# EAGLE design amplifier_v0003 - 1 Channel Test (EAGLE 6.4)

## Sheet 1 of 2
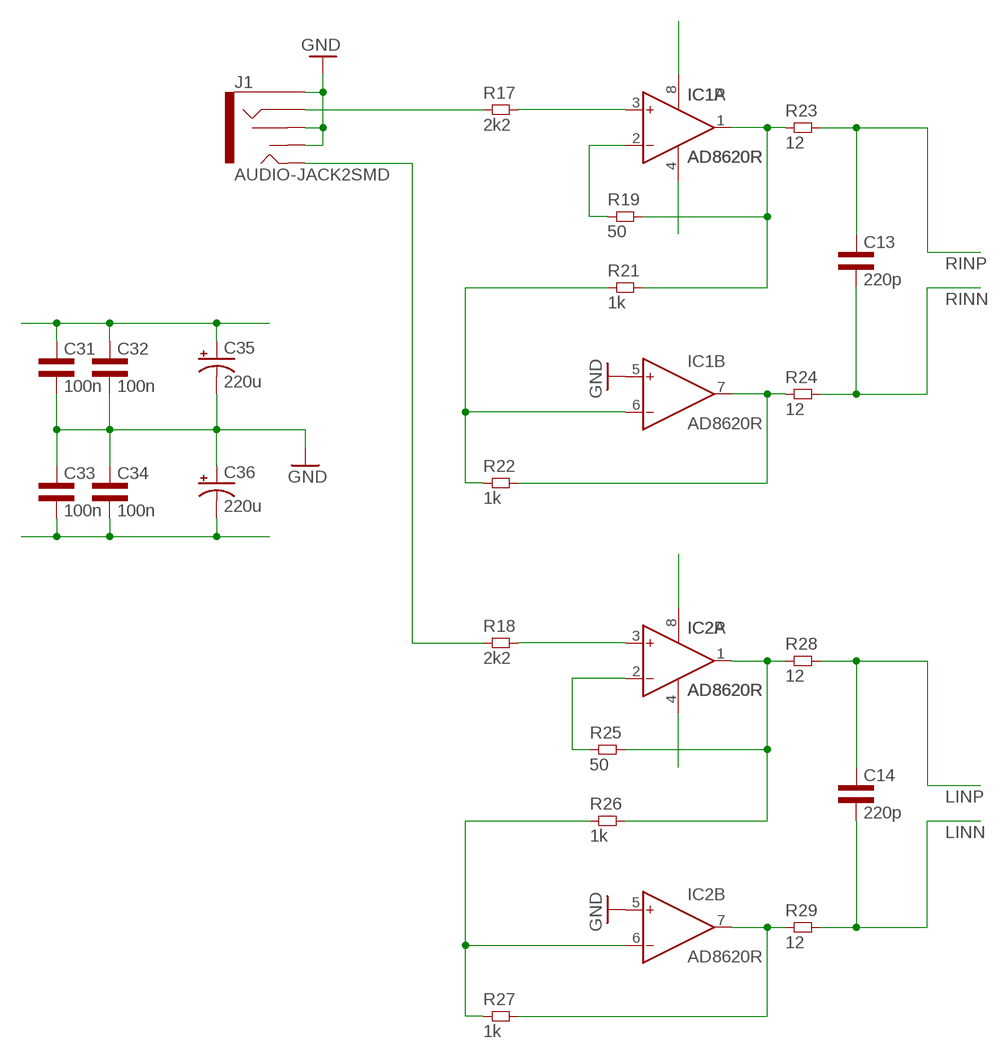
[diagram p0: schematic, sheet 1]

### Parts
C13  220p  CAP0603L3  [0603L3]
C14  220p  CAP0603L3  [0603L3]
C31  100n  CAP0603L3  [0603L3]
C32  100n  CAP0603L3  [0603L3]
C33  100n  CAP0603L3  [0603L3]
C34  100n  CAP0603L3  [0603L3]
C35  220u  CPOL-USCT7343  [CT7343]
C36  220u  CPOL-USCT7343  [CT7343]
IC1  AD8620R  [SO8]
IC2  AD8620R  [SO8]
J1  AUDIO-JACK2SMD  [AUDIO-JACK-3.5MM-SMD]
R17  2k2  RES0603L3  [0603L3]
R18  2k2  RES0603L3  [0603L3]
R19  50  RES0603L3  [0603L3]
R21  1k  RES0603L3  [0603L3]
R22  1k  RES0603L3  [0603L3]
R23  12  RES0603L3  [0603L3]
R24  12  RES0603L3  [0603L3]
R25  50  RES0603L3  [0603L3]
R26  1k  RES0603L3  [0603L3]
R27  1k  RES0603L3  [0603L3]
R28  12  RES0603L3  [0603L3]
R29  12  RES0603L3  [0603L3]

### Nets
GND: C31.P$2 C32.P$2 C33.P$1 C34.P$1 C35.- C36.+ IC1.5(B:IN+) IC2.5(B:IN+) J1.RSH J1.SLEEVE J1.TSH ; also sheet 2
LINN: C14.P$2 R29.P$2 ; also sheet 2
LINP: C14.P$1 R28.P$2 ; also sheet 2
N$7: IC1.3(A:IN+) R17.P$2
N$13: IC2.3(A:IN+) R18.P$2
N$15: J1.RING R17.P$1
N$16: J1.TIP R18.P$1
N$17: IC1.1(A:OUT) R19.P$2 R21.P$2 R23.P$1
N$18: IC1.7(B:OUT) R22.P$2 R24.P$1
N$21: IC1.6(B:IN-) R21.P$1 R22.P$1
N$22: IC1.2(A:IN-) R19.P$1
N$23: IC2.1(A:OUT) R25.P$2 R26.P$2 R28.P$1
N$24: IC2.7(B:OUT) R27.P$2 R29.P$1
N$25: IC2.6(B:IN-) R26.P$1 R27.P$1
N$26: IC2.2(A:IN-) R25.P$1
RINN: C13.P$2 R24.P$2 ; also sheet 2
RINP: C13.P$1 R23.P$2 ; also sheet 2
V+: C31.P$1 C32.P$1 C35.+ IC1.8(P:V+) IC2.8(P:V+)
V-: C33.P$2 C34.P$2 C36.- IC1.4(P:V-) IC2.4(P:V-)

## Sheet 2 of 2: Amp
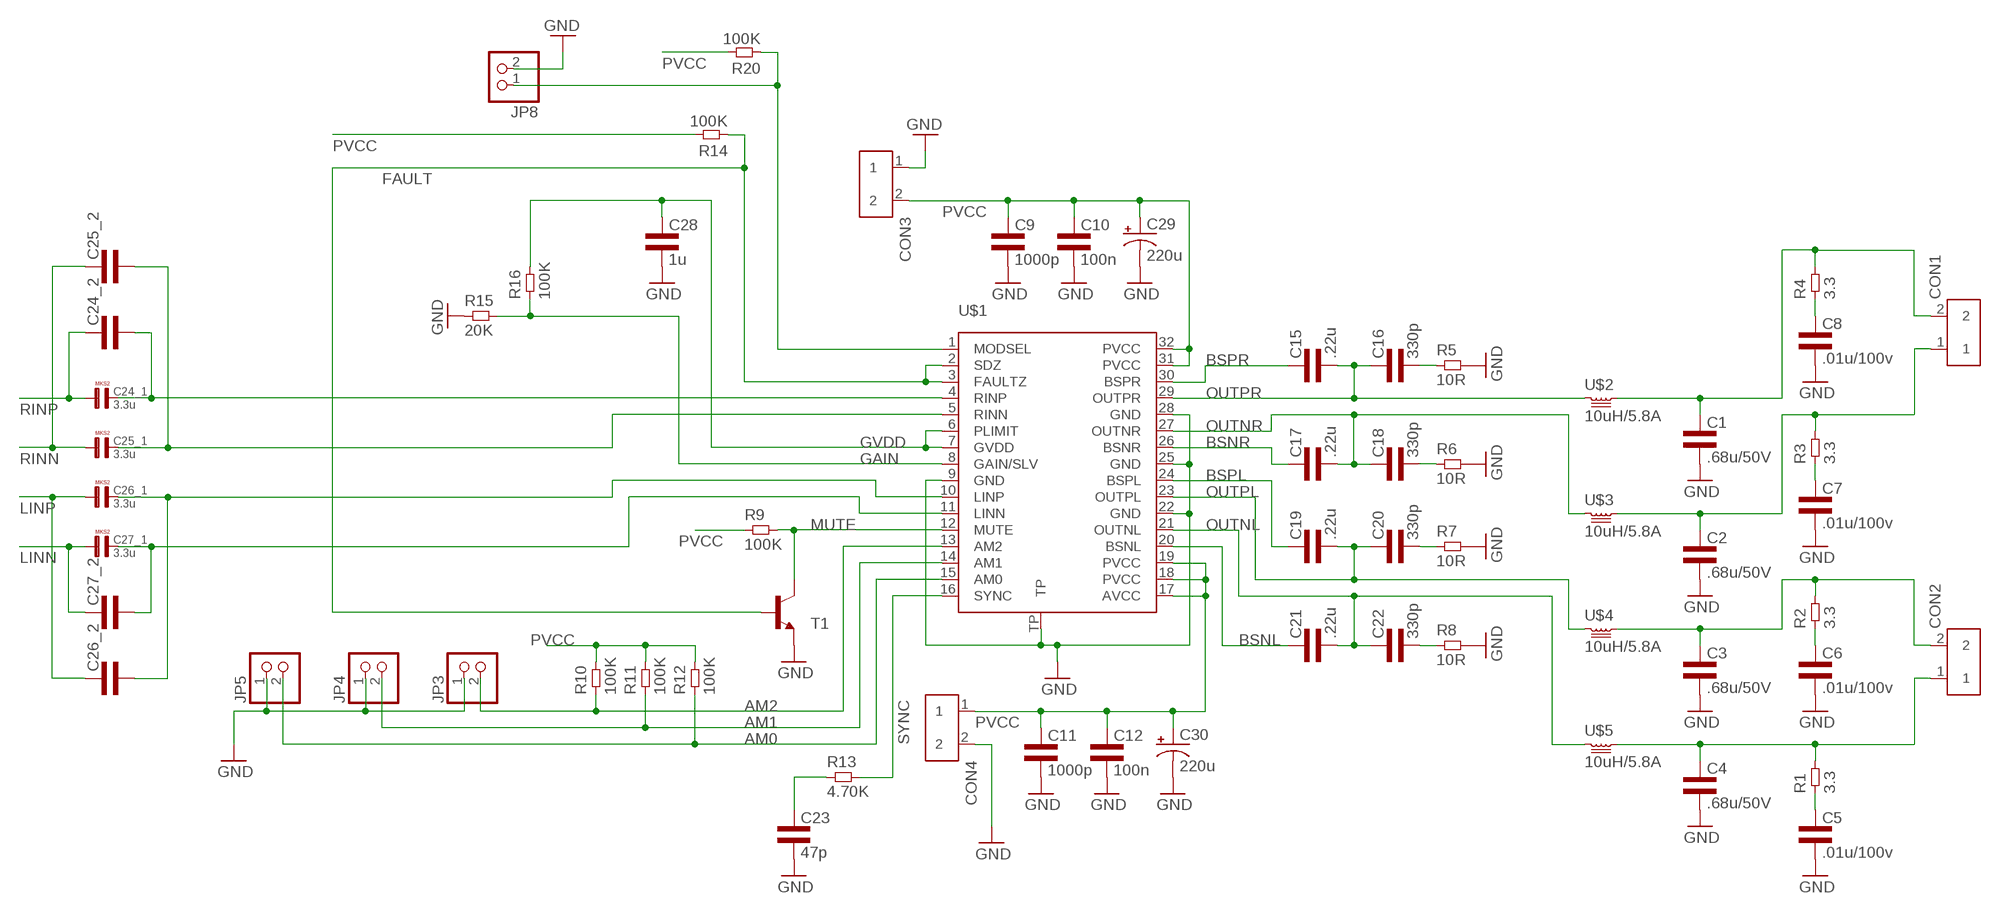
[diagram p1: schematic, sheet 2]

### Parts
C1  .68u/50V  CAP1206L3  [1206L3]
C2  .68u/50V  CAP1206L3  [1206L3]
C3  .68u/50V  CAP1206L3  [1206L3]
C4  .68u/50V  CAP1206L3  [1206L3]
C5  .01u/100v  CAP0805L3  [0805L3]
C6  .01u/100v  CAP0805L3  [0805L3]
C7  .01u/100v  CAP0805L3  [0805L3]
C8  .01u/100v  CAP0805L3  [0805L3]
C9  1000p  CAP0603L3  [0603L3]
C10  100n  CAP0603L3  [0603L3]
C11  1000p  CAP0603L3  [0603L3]
C12  100n  CAP0603L3  [0603L3]
C15  .22u  CAP0603L3  [0603L3]
C16  330p  CAP0603L3  [0603L3]
C17  .22u  CAP0603L3  [0603L3]
C18  330p  CAP0603L3  [0603L3]
C19  .22u  CAP0603L3  [0603L3]
C20  330p  CAP0603L3  [0603L3]
C21  .22u  CAP0603L3  [0603L3]
C22  330p  CAP0603L3  [0603L3]
C23  47p  CAP0603L3  [0603L3]
C24_1  3.3u  3,3µF  [R5B5K5]
C24_2  CAP1206L3  [1206L3]
C25_1  3.3u  3,3µF  [R5B5K5]
C25_2  CAP1206L3  [1206L3]
C26_1  3.3u  3,3µF  [R5B5K5]
C26_2  CAP1206L3  [1206L3]
C27_1  3.3u  3,3µF  [R5B5K5]
C27_2  CAP1206L3  [1206L3]
C28  1u  CAP0603L3  [0603L3]
C29  220u  CPOL-USG  [PANASONIC_G]
C30  220u  CPOL-USG  [PANASONIC_G]
CON1  TERM_BLOCK_2  [TERM_BLOCK_2]
CON2  TERM_BLOCK_2  [TERM_BLOCK_2]
CON3  TERM_BLOCK_2  [TERM_BLOCK_2]
CON4  TERM_BLOCK_2  [TERM_BLOCK_2]
JP3  PINHD-1X2  [1X02]
JP4  PINHD-1X2  [1X02]
JP5  PINHD-1X2  [1X02]
JP8  PINHD-1X2  [1X02]
R1  3.3  RES0603L3  [0603L3]
R2  3.3  RES0603L3  [0603L3]
R3  3.3  RES0603L3  [0603L3]
R4  3.3  RES0603L3  [0603L3]
R5  10R  RES1206L3  [1206L3]
R6  10R  RES1206L3  [1206L3]
R7  10R  RES1206L3  [1206L3]
R8  10R  RES1206L3  [1206L3]
R9  100K  RES0603L3  [0603L3]
R10  100K  RES0603L3  [0603L3]
R11  100K  RES0603L3  [0603L3]
R12  100K  RES0603L3  [0603L3]
R13  4.70K  RES0603L3  [0603L3]
R14  100K  RES0603L3  [0603L3]
R15  20K  RES0603L3  [0603L3]
R16  100K  RES0603L3  [0603L3]
R20  100K  RES0603L3  [0603L3]
T1  TRANSISTOR_MMBT2222ALT1-NPN-SOT23-BEC  [TRANSISTOR_SOT23-BEC]
U$1  TPA3116  [R-PDSO-32]
U$2  10uH/5.8A  INDUCTORDR127  [DR127]
U$3  10uH/5.8A  INDUCTORDR127  [DR127]
U$4  10uH/5.8A  INDUCTORDR127  [DR127]
U$5  10uH/5.8A  INDUCTORDR127  [DR127]

### Nets
AM0: JP5.2 R12.P$1 U$1.15(AM0)
AM1: JP4.2 R11.P$1 U$1.14(AM1)
AM2: JP3.2 R10.P$1 U$1.13(AM2)
BSNL: C21.P$1 U$1.20(BSNL)
BSNR: C17.P$1 U$1.26(BSNR)
BSPL: C19.P$1 U$1.24(BSPL)
BSPR: C15.P$1 U$1.30(BSPR)
FAULT: R14.P$1 T1.B U$1.2(SDZ) U$1.3(FAULTZ)
GAIN: R15.P$2 R16.P$1 U$1.8(GAIN/SLV)
GND: C1.2 C2.2 C3.2 C4.2 C5.2 C6.2 C7.2 C8.2 C9.P$2 C10.P$2 C11.P$2 C12.P$2 C23.P$2 C28.P$2 C29.- C30.- CON3.1 CON4.2 JP3.1 JP4.1 JP5.1 JP8.2 R5.2 R6.2 R7.2 R8.2 R15.P$1 T1.E U$1.9(GND) U$1.22(GND) U$1.25(GND) U$1.28(GND) U$1.TP ; also sheet 1
GVDD: C28.P$1 R16.P$2 U$1.6(PLIMIT) U$1.7(GVDD)
LEFT+: C3.1 CON2.2 R2.P$2 U$4.2
LEFT-: C4.1 CON2.1 R1.P$2 U$5.2
LINN: C27_1.1 C27_2.1 ; also sheet 1
LINP: C26_1.1 C26_2.1 ; also sheet 1
MUTE: R9.P$2 T1.C U$1.12(MUTE)
N$1: C27_1.2 C27_2.2 U$1.11(LINN)
N$2: C26_1.2 C26_2.2 U$1.10(LINP)
N$3: C24_1.2 C24_2.2 U$1.4(RINP)
N$4: JP8.1 R20.P$1 U$1.1(MODSEL)
N$5: C16.P$2 R5.1
N$6: C25_1.2 C25_2.2 U$1.5(RINN)
N$8: C18.P$2 R6.1
N$9: C5.1 R1.P$1
N$10: C6.1 R2.P$1
N$11: C7.1 R3.P$1
N$12: C8.1 R4.P$1
N$14: C20.P$2 R7.1
N$19: C22.P$2 R8.1
N$20: C23.P$1 R13.P$1
OUTNL: C21.P$2 C22.P$1 U$1.21(OUTNL) U$5.1
OUTNR: C17.P$2 C18.P$1 U$1.27(OUTNR) U$3.1
OUTPL: C19.P$2 C20.P$1 U$1.23(OUTPL) U$4.1
OUTPR: C15.P$2 C16.P$1 U$1.29(OUTPR) U$2.1
PVCC: C9.P$1 C10.P$1 C11.P$1 C12.P$1 C29.+ C30.+ CON3.2 CON4.1 R9.P$1 R10.P$2 R11.P$2 R12.P$2 R14.P$2 R20.P$2 U$1.17(AVCC) U$1.18(PVCC) U$1.19(PVCC) U$1.31(PVCC) U$1.32(PVCC)
RIGHT+: C1.1 CON1.2 R4.P$2 U$2.2
RIGHT-: C2.1 CON1.1 R3.P$2 U$3.2
RINN: C25_1.1 C25_2.1 ; also sheet 1
RINP: C24_1.1 C24_2.1 ; also sheet 1
SYNC: R13.P$2 U$1.16(SYNC)

## Library data of the parts
C1-C23 C24_2 C25_2 C26_2 C27_2 C28 C31-C34 = common:CAP
C24_1 C25_1 C26_1 C27_1 = Capacitor-Wima-MKS2-16v:3,3µF
C29 C30 C35 C36 = rcl:CPOL-US: POLARIZED CAPACITOR, American symbol
CON1-CON4 = common:TERM_BLOCK_2
IC1 IC2 = analog-devices:AD8620: Precision, Very Low Noise, Low Input Bias Current, Wide Bandwidth JFET Operational Amplifiers Source: http://www.analog.com/static/imported-files/data_sheets/AD8610_8620.pdf; MF: ALTERA CORPORATION; MPN: AD8620ARZ; OC_FARNELL: 9994386; OC_NEWARK: 59K6972
J1 = SparkFun-Connectors:AUDIO-JACK2: Stereo audio jack with bypass switches. Used on LilyPad MP3 board. Production SKU: CONN-10353; PROD_ID: CONN-10353
JP3-JP5 JP8 = pinhead:PINHD-1X2: PIN HEADER
R1-R29 = common:RES
T1 = logic:TRANSISTOR_*-NPN-: NPN Transistror BF959 corrected 2008.03.06
U$1 = common:TPA3116: TPA3116D2 15-W, 30-W, 50-W Filter-Free Class-D Stereo Amplifier Family With AM Avoidance
U$2-U$5 = common:INDUCTOR

## Board
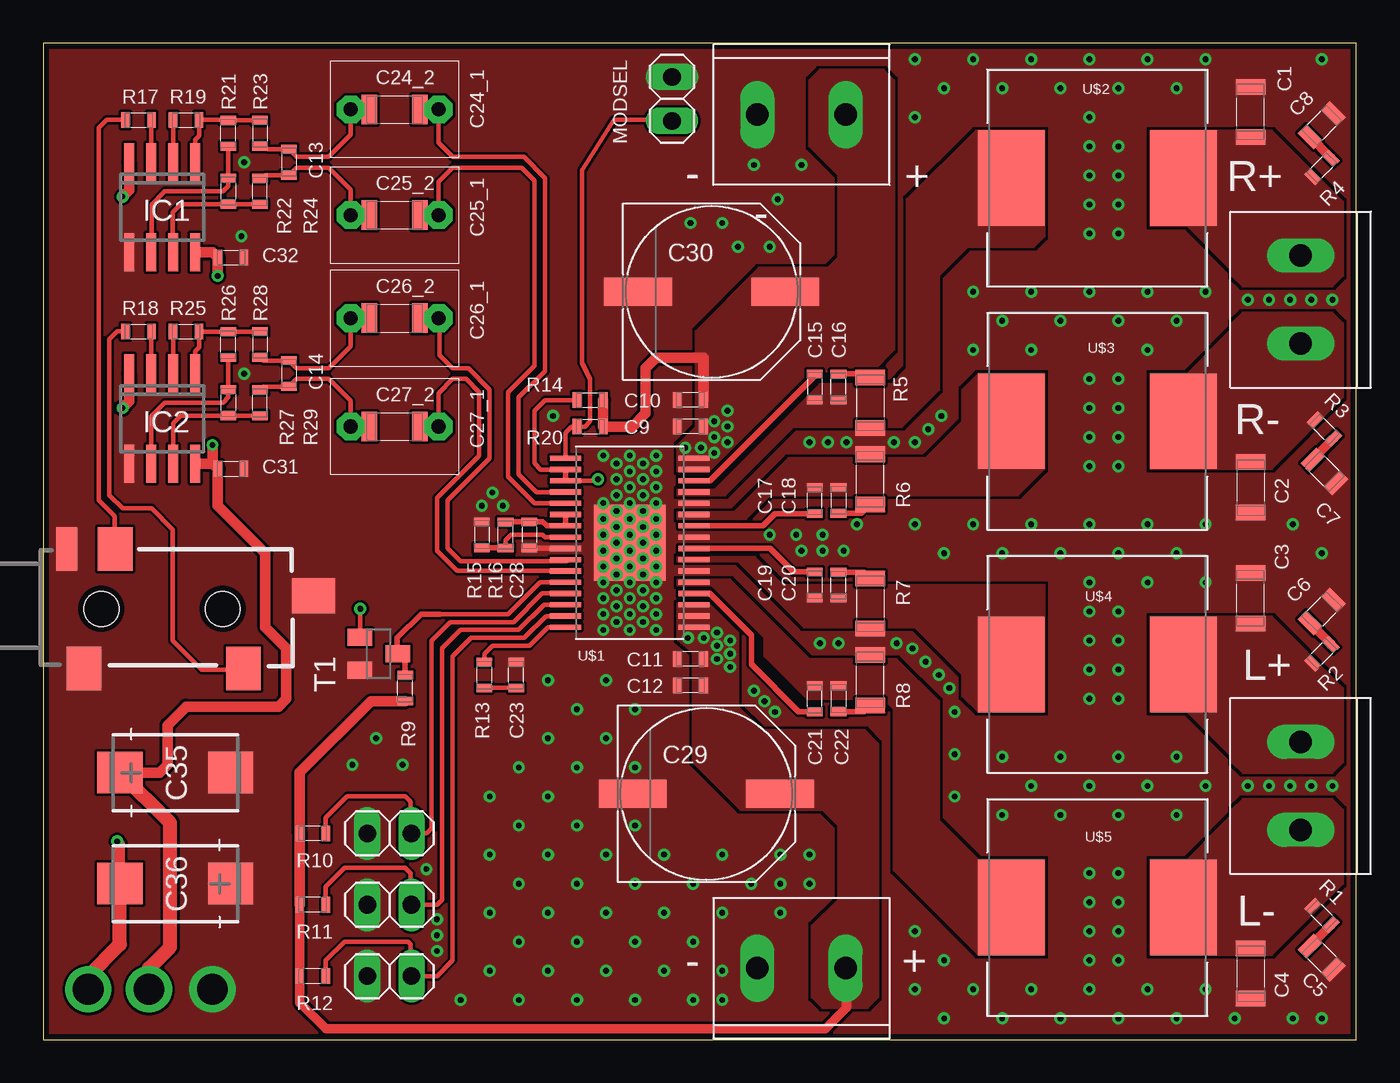
[diagram p2: board, top side]
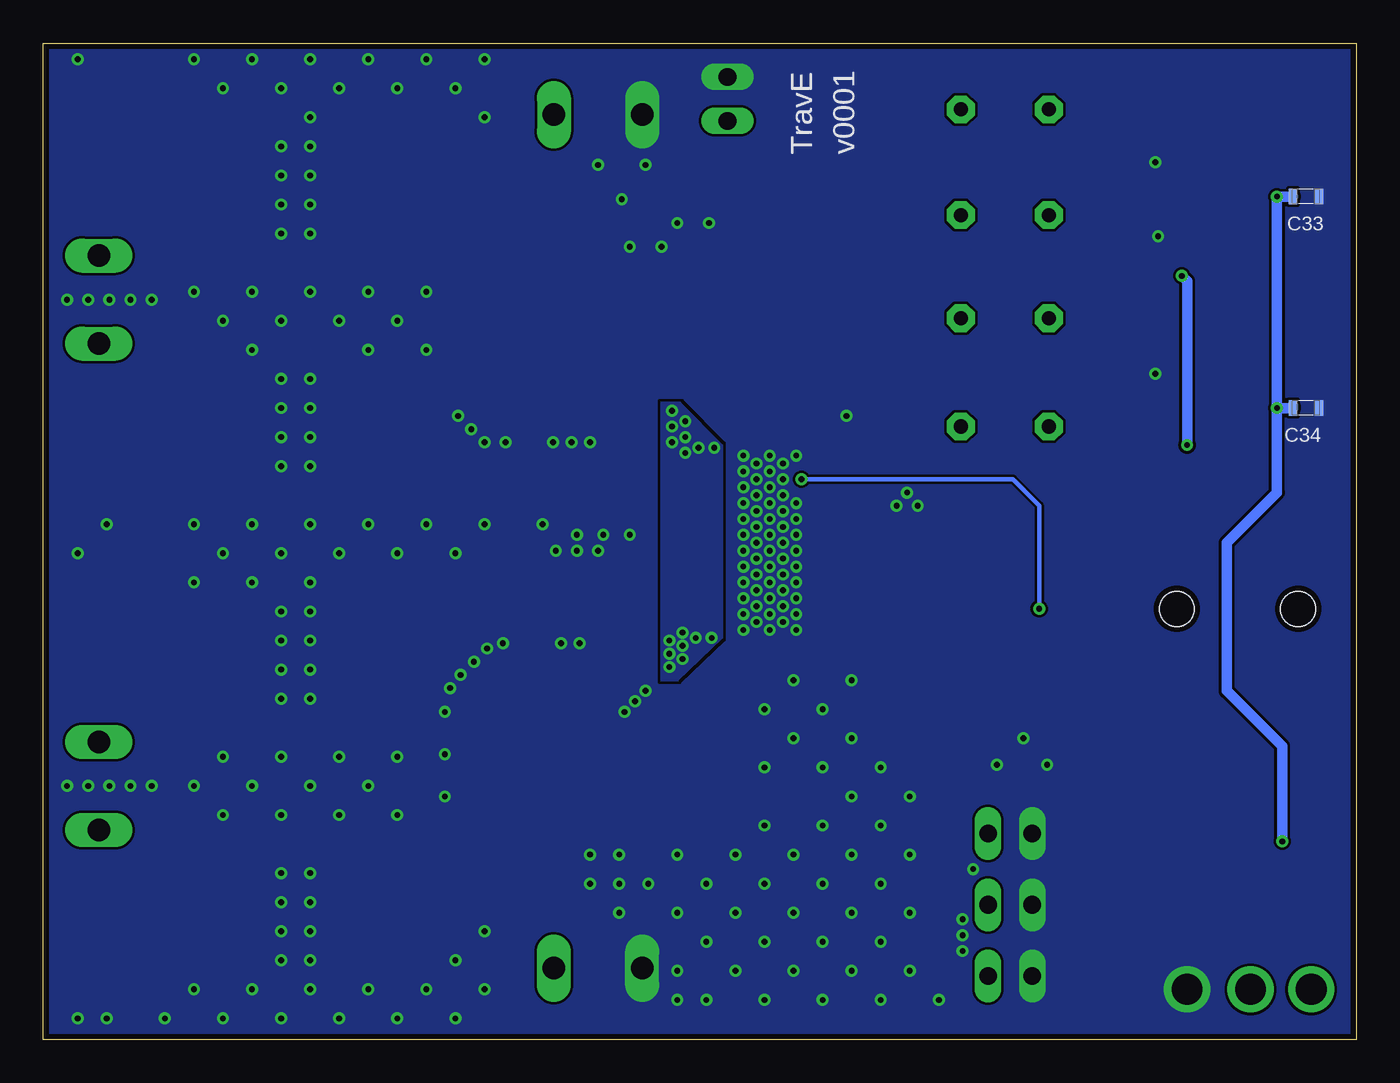
[diagram p3: board, bottom side, seen from below]

Size 75.74 x 57.45 mm. Coordinates in mm from the lower left corner, seen from the top.
Outline: 75.74,0 75.74,57.46 0,57.46 0,0 75.74,0
Copper layers (1*16): Top 0.035mm / dielectric 1.5mm / Bottom 0.035mm
Design rules "default *": minimum track width 6mil, minimum drill 13mil, track to track 6mil, track to pad 6mil, pad to pad 6mil, via to via 6mil, smd to smd 6mil, copper to edge 13mil, drill to drill 6mil, minimum pad ring 7mil, minimum via ring 7mil, stop-mask expansion 4mil, vias tented up to drill 16mil, thermal gap 10mil

### Footprints (pad centres in the part's own frame; a part is rotated, then mirrored left to right if it is on the bottom)
1206L3 = smd 0.9 x 1.7: 1 -1.45,0; 2 1.45,0
0805L3 = smd 0.7 x 1.3: 1 -0.95,0; 2 0.95,0
0603L3 = smd 0.5 x 0.9: P$1 -0.75,0; P$2 0.75,0
R5B5K5 = drill 0.813 pad 1.6 octagon: 1 -2.54,0; 2 2.54,0
PANASONIC_G = smd 3.9 x 1.6: + 4.25,0; - -4.25,0
CT7343 = smd 2.6 x 2.4: + -3.2,0; - 3.2,0
TERM_BLOCK_2 = drill 1.3 long: 1 -2.54,0; 2 2.54,0
SO8 = smd 0.6 x 2.2: 1 -1.905,-2.6; 2 -0.635,-2.6; 3 0.635,-2.6; 4 1.905,-2.6; 5 1.905,2.6; 6 0.635,2.6; 7 -0.635,2.6; 8 -1.905,2.6
AUDIO-JACK-3.5MM-SMD = smd 2 x 2.5: RING 4.3,3.45; SLEEVE 2.5,-3.45; TIP 11.7,-3.45 | smd 1.2 x 2.5: RSH 1.5,3.45 | smd 2.5 x 2: TSH 15.75,0.75 | hole 2: 3.5,0; 10.5,0
1X02 = drill 1.016 long: 1 -1.27,0; 2 1.27,0
TRANSISTOR_SOT23-BEC = smd 1 x 1.4: B -0.95,-1.1; C 0,1.1; E 0.95,-1.1
R-PDSO-32 = smd 0.3 x 1.8: 1 -4.875,-3.7; 2 -4.225,-3.7; 3 -3.575,-3.7; 4 -2.925,-3.7; 5 -2.275,-3.7; 6 -1.625,-3.7; 7 -0.975,-3.7; 8 -0.325,-3.7; 9 0.325,-3.7; 10 0.975,-3.7; 11 1.625,-3.7; 12 2.275,-3.7; 13 2.925,-3.7; 14 3.575,-3.7; 15 4.225,-3.7; 16 4.875,-3.7; 17 4.875,3.7; 18 4.225,3.7; 19 3.575,3.7; 20 2.925,3.7; 21 2.275,3.7; 22 1.625,3.7; 23 0.975,3.7; 24 0.325,3.7; 25 -0.325,3.7; 26 -0.975,3.7; 27 -1.625,3.7; 28 -2.275,3.7; 29 -2.925,3.7; 30 -3.575,3.7; 31 -4.225,3.7; 32 -4.875,3.7 | smd 4.36 x 4.11: TP 0,0
DR127 = smd 3.85 x 5.5: 1 -4.975,0; 2 4.975,0

### Placement (x,y rotation side)
C1  69.65,53.49 90 top
C2  69.65,31.85 270 top
C3  69.65,25.45 90 top
C4  69.65,3.81 270 top
C5  73.76,4.72 315 top
C6  73.76,24.69 45 top
C7  73.91,32.77 315 top
C8  73.76,52.73 45 top
C9  37.34,35.36 180 top
C10  37.34,36.88 180 top
C11  37.34,21.95 180 top
C12  37.34,20.42 180 top
C13  14.17,50.6 270 top
C14  14.17,38.4 270 top
C15  44.5,37.64 270 top
C16  45.87,37.64 90 top
C17  44.5,31.09 90 top
C18  45.87,31.09 270 top
C19  44.5,26.21 270 top
C20  45.87,26.21 90 top
C21  44.5,19.66 90 top
C22  45.87,19.66 270 top
C23  27.28,21.03 90 top
C24_1  20.27,53.64 0 top
C24_2  20.27,53.64 0 top
C25_1  20.27,47.55 0 top
C25_2  20.27,47.55 0 top
C26_1  20.27,41.61 0 top
C26_2  20.27,41.61 0 top
C27_1  20.27,35.36 0 top
C27_2  20.27,35.36 0 top
C28  28.04,29.11 270 top
C29  38.25,14.17 0 top
C30  38.56,43.13 0 top
C31  10.82,32.92 0 top
C32  10.82,45.11 0 top
C33  2.9,48.62 180 bottom
C34  2.9,36.42 180 bottom
C35  7.62,15.39 0 top
C36  7.62,8.99 180 top
CON1  72.54,42.67 90 top
CON2  72.54,14.63 90 top
CON3  43.74,4.11 0 top
CON4  43.74,53.34 180 top
IC1  6.86,48.01 180 top
IC2  6.86,35.81 180 top
J1  -0.15,24.84 0 top
JP3  19.96,11.89 0 top
JP4  19.96,7.77 0 top
JP5  19.96,3.66 0 top
JP8  36.27,54.25 90 top
R1  73.76,7.16 135 top
R2  73.76,22.25 225 top
R3  73.91,35.2 135 top
R4  73.76,50.29 225 top
R5  47.7,36.73 270 top
R6  47.7,32.31 90 top
R7  47.7,25.15 270 top
R8  47.7,20.73 90 top
R9  20.88,20.27 90 top
R10  15.54,11.89 180 top
R11  15.54,7.77 180 top
R12  15.54,3.66 180 top
R13  25.45,21.03 90 top
R14  31.55,36.88 0 top
R15  25.3,29.11 270 top
R16  26.67,29.11 90 top
R17  5.49,53.04 0 top
R18  5.49,40.84 0 top
R19  8.23,53.04 0 top
R20  31.55,35.36 0 top
R21  10.67,52.27 90 top
R22  10.67,48.92 270 top
R23  12.5,52.27 270 top
R24  12.5,48.92 90 top
R25  8.23,40.84 0 top
R26  10.67,40.08 90 top
R27  10.67,36.73 270 top
R28  12.5,40.08 270 top
R29  12.5,36.73 90 top
T1  19.35,22.25 270 top
U$1  33.83,28.65 270 top
U$2  60.81,49.68 0 top
U$3  60.81,35.66 0 top
U$4  60.81,21.64 0 top
U$5  60.81,7.62 0 top

### Tracks (layer width: path | path; a pad name or v marks a point on that pad's centre or on a via)
AM0
  Top 0.254: U$1.15 29,24.43 27.74,23.17 24.69,23.17 23.62,22.1 23.62,4.57 22.71,3.66 JP5.2 21.18,3.71 21.18,5.49 21.03,5.64 17.37,5.64 16.29,4.56 R12.P$1
AM1
  Top 0.254: U$1.14 28.89,25.08 27.43,23.62 24.08,23.62 23.01,22.56 23.01,8.08 22.71,7.77 JP4.2 21.18,7.82 21.18,9.6 20.88,9.91 17.37,9.91 16.29,8.83 R11.P$1
AM2
  Top 0.254: U$1.13 28.77,25.73 27.13,24.08 23.47,24.08 22.4,23.01 22.4,12.19 22.1,11.89 JP3.2 21.18,11.94 21.18,13.72 20.88,14.02 17.53,14.02 16.29,12.79 R10.P$1
BSNL
  Top 0.305: U$1.20 38.43,25.73 40.84,23.32 40.84,21.64 43.57,18.91 C21.P$1
BSNR
  Top 0.305: U$1.26 41.51,29.63 42.21,30.33 44.49,30.33 C17.P$1
BSPL
  Top 0.305: U$1.24 41.93,28.33 43.28,26.98 44.49,26.98 C19.P$1
BSPR
  Top 0.305: C15.P$1 44.64,38.39 38.47,32.23 U$1.30
FAULT  (via drill 0.33)
  Top 0.254: U$1.2 28.69,32.88 28.35,33.22 28.35,36.27 28.96,36.88 R14.P$1 | U$1.3 31.92,32.23 v32,32.31 | v18.29,24.84 18.29,23.23 T1.B
  Top 0.305: U$1.2 U$1.3
  Bottom 0.254: v32,32.31 19.81,32.31 18.29,30.79 v18.29,24.84
GAIN
  Top 0.254: U$1.8 28.94,28.98 28.8,29.11 26.97,29.11 26.67,28.8 R16.P$1
  Top 0.305: R15.P$2 R16.P$1
GND  (via drill 0.33, 1.78)
  Top 0.305: U$1.9 28.07,28.33 C28.P$2
  other vias: 45.26,34.44 46.33,34.44 32.31,30.02 32.31,29.11 32.31,28.19 32.31,27.28 33.07,29.57 33.07,28.65 33.07,27.74 33.07,26.82 33.07,30.48 33.83,30.02 33.83,29.11 33.83,28.19 33.83,27.28 34.59,30.48 34.59,29.57 34.59,28.65 34.59,27.74 34.59,26.82 35.36,27.28 35.36,28.19 35.36,29.11 35.36,30.02 32.31,30.94 32.31,33.68 33.07,31.39 33.07,32.31 33.07,33.22 33.83,33.68 33.83,32.77 33.83,31.85 33.83,30.94 34.59,33.22 34.59,32.31 34.59,31.39 35.36,33.68 35.36,32.77 35.36,31.85 35.36,30.94 32.31,26.37 32.31,25.45 32.31,24.54 32.31,23.62 33.07,25.91 33.07,24.99 33.07,24.08 33.83,26.37 33.83,25.45 33.83,24.54 33.83,23.62 34.59,25.91 34.59,24.99 34.59,24.08 35.36,26.37 35.36,25.45 35.36,24.54 35.36,23.62 44.2,34.44 41.91,29.11 43.43,29.11 43.74,28.19 44.96,29.11 44.96,28.19 41,20.12 42.21,18.9 41.61,19.51 44.81,22.86 45.87,22.86 49.23,22.86 50.14,22.56 50.9,21.79 51.66,21.03 52.27,20.27 52.58,18.9 52.58,16.46 52.58,14.02 69.49,14.63 70.71,14.63 71.93,14.63 73.15,14.63 74.37,14.63 74.37,42.67 73.15,42.67 71.93,42.67 70.71,42.67 69.49,42.67 49.07,34.44 50.29,34.44 51.05,35.2 51.05,35.2 51.82,35.97 41,50.44 43.74,50.44 42.37,48.46 37.34,47.09 40.08,45.72 41.91,45.72 39.17,47.09 29.11,20.73 30.78,19.05 29.11,17.37 32.46,17.37 34.14,15.7 30.78,15.7 34.14,12.34 35.81,10.67 37.49,8.99 39.17,10.67 27.43,15.7 29.11,14.02 30.78,12.34 32.46,10.67 34.14,8.99 35.81,7.32 37.49,5.64 25.76,14.02 27.43,12.34 29.11,10.67 30.78,8.99 32.46,7.32 34.14,5.64 35.81,3.96 37.49,2.29 34.14,2.29 30.78,2.29 27.43,2.29 24.08,2.29 32.46,3.96 29.11,3.96 25.76,3.96 27.43,5.64 30.78,5.64 29.11,7.32 27.43,8.99 25.76,10.67 25.76,7.32 39.17,7.32 42.52,7.32 44.2,8.99 42.52,10.67 50.29,56.54 51.97,54.86 53.64,56.54 55.32,54.86 57,56.54 58.67,54.86 60.35,56.54 62.03,54.86 63.7,56.54 65.38,54.86 67.06,56.54 60.35,53.19 62.03,51.51 62.03,48.16 60.35,46.48 57,43.13 53.64,43.13 55.32,41.45 53.64,39.78 57,39.78 58.67,41.45 60.35,43.13 63.7,43.13 67.06,43.13 62.03,41.45 65.38,41.45 63.7,39.78 60.35,38.1 60.35,36.42 60.35,34.75 60.35,33.07 62.03,38.1 62.03,36.42 62.03,34.75 62.03,33.07 46.94,29.72 50.29,29.72 53.64,29.72 57,29.72 60.35,29.72 63.7,29.72 67.06,29.72 46.18,28.19 51.97,28.04 55.32,28.04 58.67,28.04 62.03,28.04 65.38,28.04 60.35,26.37 63.7,26.37 67.06,26.37 60.35,24.69 60.35,23.01 60.35,21.34 60.35,19.66 62.03,24.69 62.03,23.01 62.03,21.34 62.03,19.66 55.32,16.31 58.67,16.31 62.03,16.31 65.38,16.31 57,14.63 60.35,14.63 63.7,14.63 67.06,14.63 55.32,12.95 58.67,12.95 62.03,12.95 65.38,12.95 60.35,9.6 62.03,9.6 62.03,7.92 62.03,6.25 60.35,6.25 60.35,7.92 60.35,4.57 62.03,4.57 50.29,6.25 50.29,2.9 51.97,4.57 51.97,1.22 53.64,2.9 57,2.9 60.35,2.9 63.7,2.9 67.06,2.9 55.32,1.22 58.67,1.22 62.03,1.22 65.38,1.22 68.73,1.22 73.76,1.22 72.09,1.22 73.76,28.04 72.09,29.72 60.35,51.51 60.35,49.83 60.35,48.16 62.03,49.83 62.03,46.48 50.29,53.19 73.76,56.54 32.46,20.73 34.14,19.05 44.2,10.67 42.52,8.99 40.84,8.99 39.17,3.96 39.17,2.29 25.3,30.78 26.52,30.78 25.91,31.55 11.43,46.33 29.41,35.97 22.1,9.83 22.71,6.93 22.71,6.02 22.71,5.11 9.75,2.9 11.58,38.4 11.58,50.6 17.83,15.85 19.2,17.37 20.73,15.85
  pour Top (rank 6, no thermals): 0.3,0.3 0.3,57.15 75.44,57.15 75.44,0.3
  pour Bottom (rank 6, no thermals): 0.3,0.3 0.3,57.15 75.44,57.15 75.44,0.3
GVDD
  Top 0.305: U$1.6 U$1.7 29.05,29.63 28.8,29.87 28.05,29.87 C28.P$1 R16.P$2
LEFT+
  pour Top (no thermals): 63.86,18.9 65.99,18.9 68.58,16.31 68.58,16 69.19,15.39 74.37,15.39 74.98,16 74.98,20.27 70.87,24.38 63.86,24.38
LEFT-
  pour Top (no thermals): 63.86,4.88 70.87,4.88 74.98,8.99 74.98,13.26 74.37,13.87 69.19,13.87 68.58,13.26 68.58,12.95 65.99,10.36 63.86,10.36
LINN
  Top 0.254: R29.P$2 12.67,37.66 C14.P$2 14.62,38.1 16.46,38.1 17.73,36.83 C27_1.1
  Top 0.61: C27_1.1 C27_2.1
LINP
  Top 0.254: R28.P$2 12.67,39.16 C14.P$1 14.62,38.71 16.46,38.71 17.73,39.98 C26_1.1
  Top 0.61: C26_1.1 C26_2.1
MUTE
  Top 0.254: U$1.12 28.66,26.38 26.82,24.54 22.86,24.54
  Top 0.305: 22.86,24.54 21.79,24.54 20.42,23.17 20.42,22.28 T1.C 20.88,21.83 R9.P$2
N$1
  Top 0.254: C27_1.2 22.81,37.29 23.62,38.1 24.38,38.1 25.15,37.34 25.15,33.68 22.71,31.24 22.71,28.19 23.88,27.03 U$1.11
  Top 0.61: C27_1.2 C27_2.2
N$2
  Top 0.254: U$1.10 30.13,27.63 30.18,27.58 24.08,27.58 23.32,28.35 23.32,31.09 25.76,33.53 25.76,37.49 24.54,38.71 23.62,38.71 22.86,39.47 22.86,41.4 C26_1.2
  Top 0.61: C26_1.2 C26_2.2
N$3
  Top 0.254: C24_1.2 22.81,51.71 23.62,50.9 27.74,50.9 28.96,49.68 28.96,38.56 27.43,37.03 27.43,32.61 28.47,31.58 U$1.4
  Top 0.61: C24_1.2 C24_2.2
N$4
  Top 0.254: U$1.1 30.13,35.01 30.48,35.36 R20.P$1 31.24,35.36 31.55,35.66 31.55,38.1 31.09,39.01 31.09,50.14 32.92,53.04 36.22,53.04 JP8.1
N$5
  Top 0.305: C16.P$2 47.49,38.39 R5.1
N$6
  Top 0.254: C25_1.2 22.81,49.48 23.62,50.29 27.58,50.29 28.35,49.53 28.35,38.86 26.82,37.34 26.82,32.46 28.35,30.94 30.12,30.94 U$1.5
  Top 0.61: C25_1.2 C25_2.2
N$7
  Top 0.254: IC1.3 6.22,53.02 R17.P$2
N$8
  Top 0.305: C18.P$2 47.18,30.34 R6.1
N$9
  Top 0.559: R1.P$1 74.29,6.6 C5.1
N$10
  Top 0.559: R2.P$1 74.29,22.82 C6.1
N$11
  Top 0.559: C7.1 73.24,33.47 R3.P$1
N$12
  Top 0.559: R4.P$1 74.29,50.86 C8.1
N$13
  Top 0.254: IC2.3 6.22,40.83 R18.P$2
N$14
  Top 0.305: C20.P$2 47.33,26.96 R7.1
N$15
  Top 0.254: R17.P$1 3.66,53.04 3.2,52.58 3.2,31.09 4.11,30.18 4.11,28.32 J1.RING
N$16
  Top 0.254: R18.P$1 4.27,40.84 3.81,40.39 3.81,31.39 4.57,30.63 6.25,30.63 7.47,29.41 7.47,23.01 9.14,21.34 11.49,21.34 J1.TIP
N$17
  Top 0.254: R23.P$1 R21.P$2 R19.P$2 8.99,53.02 8.99,52.12 8.76,51.89 IC1.1
N$18
  Top 0.254: IC1.7 7.47,45.43 7.47,47.7 7.94,48.17 R22.P$2 R24.P$1
N$19
  Top 0.305: C22.P$2 47.33,18.91 R8.1
N$20
  Top 0.254: R13.P$1 C23.P$1
N$21
  Top 0.254: R21.P$1 R22.P$1 10.67,49.23 10.36,48.92 7.01,48.92 6.25,48.16 6.25,45.43 IC1.6
N$22
  Top 0.254: IC1.2 7.49,53.02 R19.P$1
N$23
  Top 0.254: IC2.1 8.76,39.7 8.99,39.93 8.99,40.83 | 8.99,40.83 R26.P$2 R28.P$1 | 8.99,40.83 R25.P$2
N$24
  Top 0.254: IC2.7 7.49,35.53 7.92,35.97 10.66,35.97 R27.P$2 R29.P$1
N$25
  Top 0.254: IC2.6 6.22,35.94 7.01,36.73 10.36,36.73 10.67,37.03 R27.P$1 R26.P$1
N$26
  Top 0.254: IC2.2 7.49,40.83 R25.P$1
OUTNL
  pour Top (no thermals): 36.58,26.21 38.56,26.21 41.61,23.16 41.61,22.1 44.04,19.66 48.46,19.66 49.07,19.05 49.07,9.75 53.95,4.88 57.76,4.88 57.76,10.36 53.95,10.36 51.66,12.65 51.66,19.51 49.23,21.95 44.2,21.95 39.62,26.52 36.58,26.52
OUTNR
  pour Top (no thermals): 36.58,30.4 39.85,30.4 42.98,33.53 50.9,33.53 53.04,35.66 53.04,37.49 53.95,38.4 57.76,38.4 57.76,32.92 56.24,31.39 41.91,31.39 40.54,30.02 36.58,30.02
OUTPL
  pour Top (no thermals): 36.58,27.81 41.07,27.81 42.67,26.21 57.76,26.21 57.76,18.9 53.95,18.9 53.04,19.81 53.04,21.03 50.29,23.77 43.89,23.77 40.08,27.58 36.58,27.58
OUTPR
  pour Top (no thermals): 36.58,31.7 38.71,31.7 44.81,37.8 48.92,37.8 49.83,38.71 49.83,48.46 53.8,52.43 57.76,52.43 57.76,46.33 57.15,45.72 53.34,45.72 51.66,44.04 51.66,37.49 49.53,35.36 43.28,35.36 39.32,31.39 36.58,31.39
PVCC  (via drill 0.33)
  Top 0.559: CON3.2 46.33,4.06 46.33,1.83 45.11,0.61 16.31,0.61 14.79,2.12 R12.P$2 R11.P$2
  Top 0.61: R9.P$1 18.9,19.51 14.79,15.4 R10.P$2 R11.P$2 | R14.P$2 R20.P$2 33.99,35.36 34.75,36.12 34.75,38.71 35.36,39.32 38.1,39.32 38.1,36.89 C10.P$1
  other vias: 38.71,34.75 39.47,35.36 39.62,23.01 39.62,22.25 39.47,36.27 38.71,35.66 38.86,21.95 39.62,21.49 38.71,33.83 39.47,34.44 37.03,34.14 37.95,34.14 38.86,22.71 38.86,23.47 37.19,23.16 38.1,23.16
  pour Top (no thermals): 36.58,25.15 36.58,23.09 37.49,22.33 37.49,16 40.23,13.26 44.96,13.26 45.87,12.34 45.87,8.08 44.35,6.55 44.35,2.44 44.96,1.83 47.55,1.83 48.16,2.44 48.16,17.07 47.4,17.83 41.45,17.83 40.08,19.2 40.08,23.47 38.4,25.15 38.4,25.07 38.33,25.15
  pour Top (no thermals): 36.58,32.77 38.4,32.77 44.2,38.56 47.85,38.56 49.07,39.78 49.07,55.32 48.46,55.93 44.81,55.93 44.2,55.32 44.2,51.51 45.87,49.83 45.87,45.11 45.26,44.5 41.3,44.5 37.64,40.84 37.64,35.36 36.58,34.29
  pour Bottom (no thermals): 40.08,36.73 40.08,20.73 39.17,20.73 36.58,23.16 36.58,34.29 39.01,36.73
RIGHT+
  pour Top (no thermals): 63.86,46.94 65.99,46.94 68.58,44.35 68.58,44.04 69.19,43.43 74.37,43.43 74.98,44.04 74.98,48.31 70.87,52.43 63.86,52.43
RIGHT-
  pour Top (no thermals): 63.86,32.92 70.87,32.92 74.98,37.03 74.98,41.3 74.37,41.91 69.19,41.91 68.58,41.3 68.58,41 65.99,38.4 63.86,38.4
RINN
  Top 0.254: C25_1.1 17.73,49.02 16.46,50.29 14.62,50.29 C13.P$2 14.16,49.84 12.8,49.84 12.64,49.67 R24.P$2
  Top 0.61: C25_1.1 C25_2.1
RINP
  Top 0.254: C24_1.1 17.73,52.17 16.46,50.9 14.62,50.9 C13.P$1 14.16,51.36 12.95,51.36 12.79,51.52 R23.P$2
  Top 0.61: C24_1.1 C24_2.1
SYNC
  Top 0.254: U$1.16 29.11,23.78 28.04,22.71 25.91,22.71 25.45,22.25 R13.P$2
V+  (via drill 0.33, 1.78)
  Top 0.61: IC2.8 9.77,33.21 | 9.77,33.21 C31.P$1 10.06,32.91 10.06,30.79 12.8,28.04 12.8,23.77 14.02,22.56 14.02,19.66 13.56,19.2 8.23,19.2 7.16,18.14 7.16,15.85 6.71,15.39 C35.+ | IC1.8 9.77,45.41 C32.P$1 10.06,45.1 v10.06,44.04 | 9.77,33.21 9.77,34.27 v9.75,34.29
  Top 0.813: v6.1,2.9 6.1,4.12 7.32,5.33 7.32,12.5 C35.+
  Bottom 0.61: v9.75,34.29 9.75,43.74 v10.06,44.04
V-  (via drill 0.33, 1.78)
  Top 0.61: IC1.4 4.95,49 v4.57,48.62 | IC2.4 4.95,36.8 v4.57,36.42 | C36.- 4.42,11.28 v4.27,11.43
  Top 0.813: v2.59,2.9 2.59,3.66 4.42,5.49 C36.-
  Bottom 0.61: C33.P$2 v4.57,48.62 v4.57,36.42 | v4.57,36.42 3.81,36.42 3.66,36.58 3.66,36.44 C34.P$2 | v4.27,11.43 4.27,16.92 7.47,20.12 7.47,28.65 4.57,31.55 v4.57,36.42

### Text on the board
tPlace: MODSEL | - | + | R+ | - | R- | L+ | L- | - | +
bPlace: v0001 | TravE